# EAGLE design Roland (EAGLE 6.6.0)

## Sheet 1 of 2
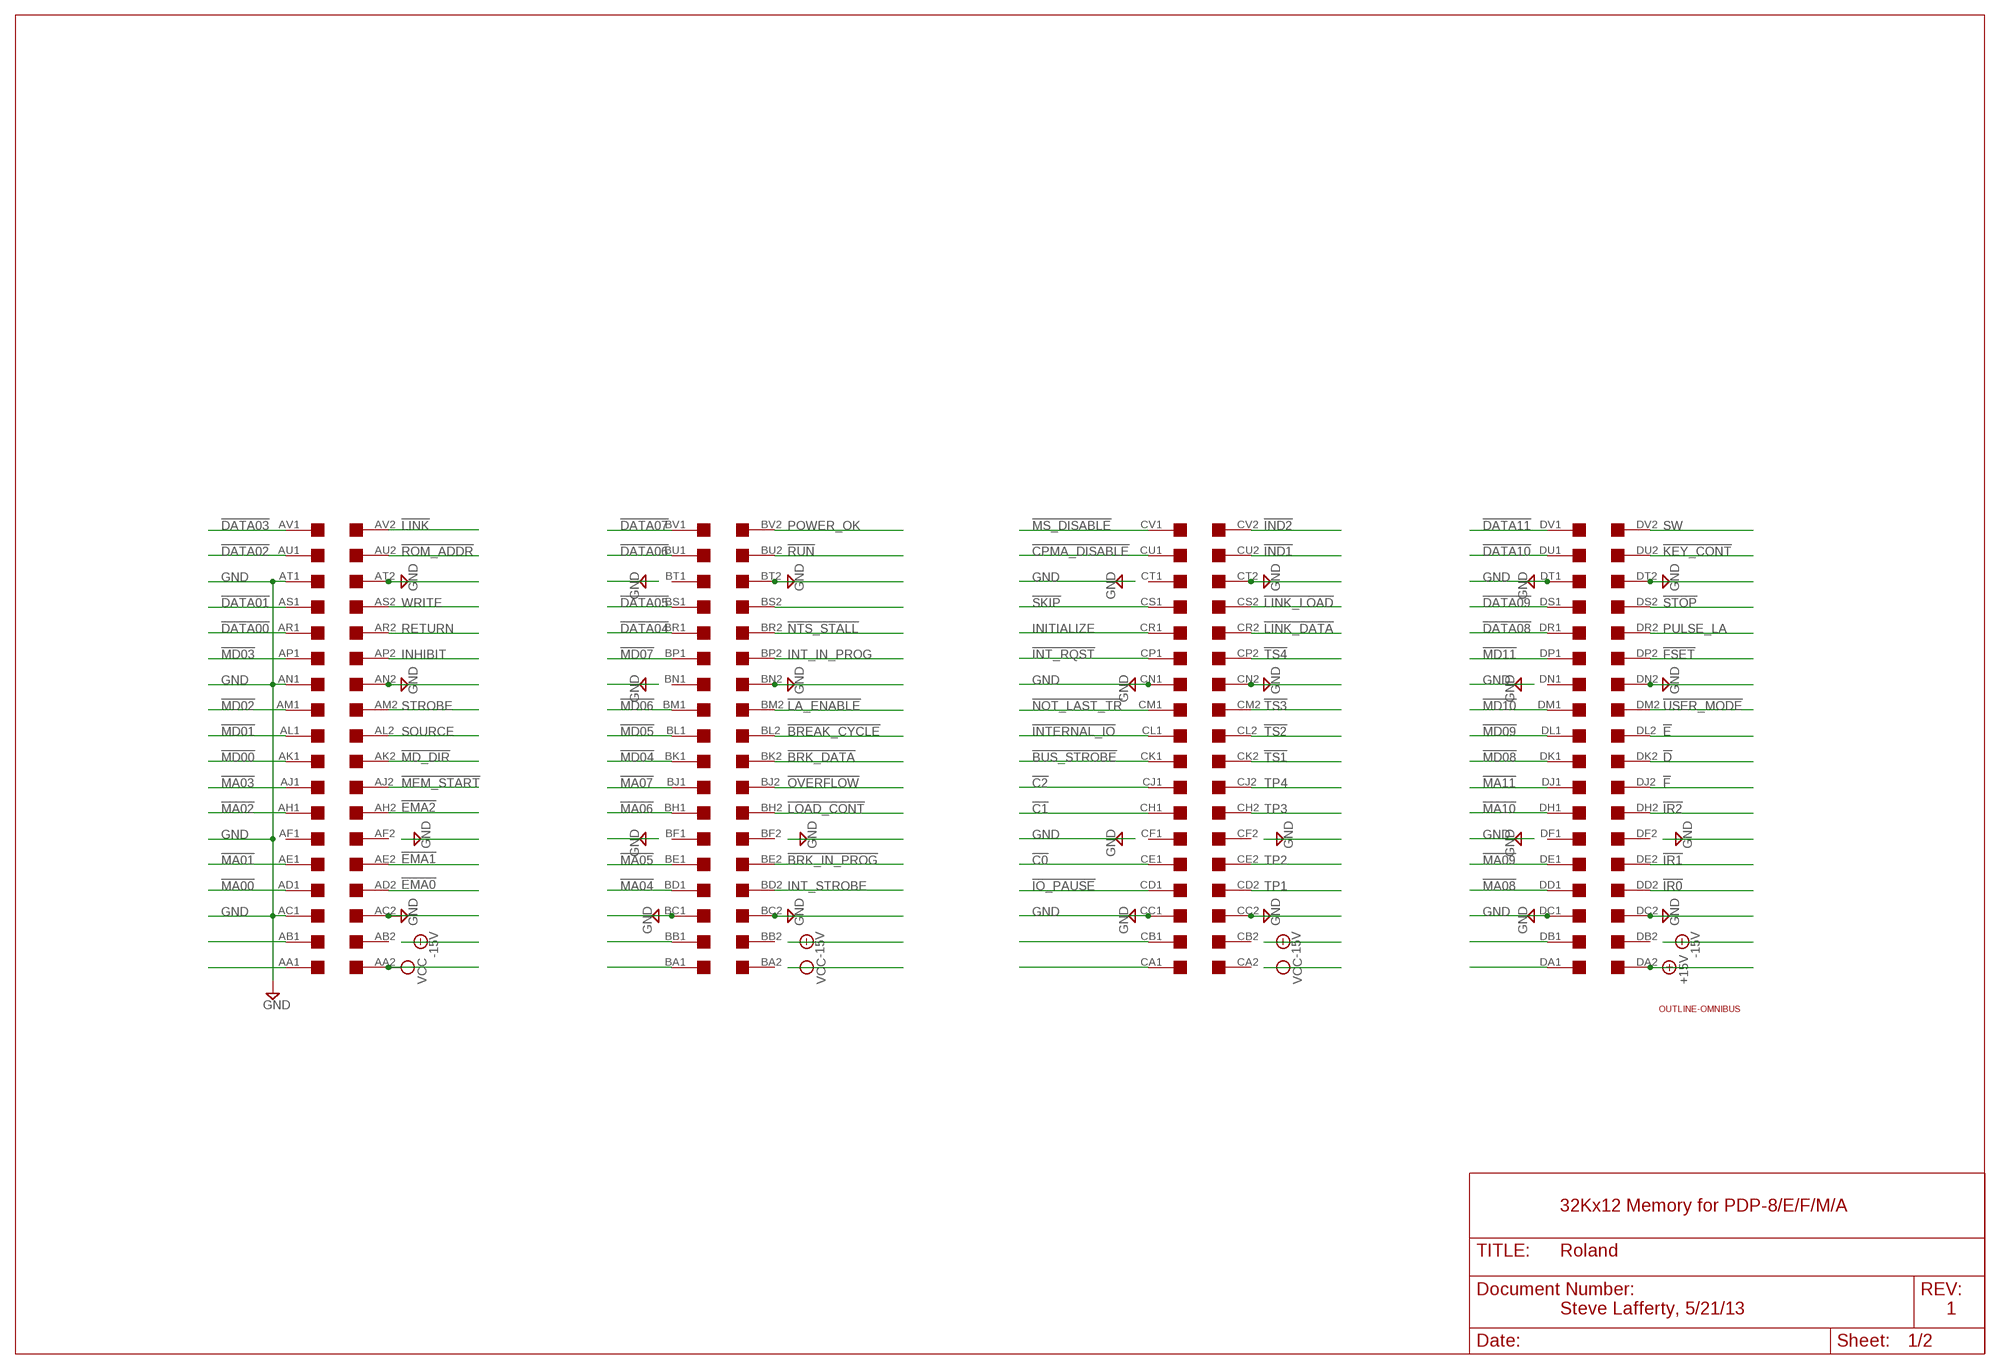
[diagram p0: schematic, sheet 1]

### Parts
J1  EDGE  QUAD  [EDGE-CON8]
U$1  OUTLINE-OMNIBUS  [OMNIBUS]

### Nets
!BREAK_CYCLE: J1.BL2
!BRK_DATA: J1.BK2 ; also sheet 2
!BRK_IN_PROG: J1.BE2
!BUS_STROBE: J1.CK1
!C0: J1.CE1
!C1: J1.CH1
!C2: J1.CJ1
!CPMA_DISABLE: J1.CU1
!D: J1.DK2
!DATA00: J1.AR1 ; also sheet 2
!DATA01: J1.AS1 ; also sheet 2
!DATA02: J1.AU1 ; also sheet 2
!DATA03: J1.AV1 ; also sheet 2
!DATA04: J1.BR1 ; also sheet 2
!DATA05: J1.BS1 ; also sheet 2
!DATA06: J1.BU1 ; also sheet 2
!DATA07: J1.BV1 ; also sheet 2
!DATA08: J1.DR1 ; also sheet 2
!DATA09: J1.DS1 ; also sheet 2
!DATA10: J1.DU1 ; also sheet 2
!DATA11: J1.DV1 ; also sheet 2
!E: J1.DL2
!EMA0: J1.AD2
!EMA1: J1.AE2
!EMA2: J1.AH2
!F: J1.DJ2
!FSET: J1.DP2
!IND1: J1.CU2
!IND2: J1.CV2
!INT_RQST: J1.CP1
!INTERNAL_IO: J1.CL1
!IO_PAUSE: J1.CD1
!IR0: J1.DD2
!IR1: J1.DE2
!IR2: J1.DH2
!KEY_CONT: J1.DU2 ; also sheet 2
!LA_ENABLE: J1.BM2 ; also sheet 2
!LINK: J1.AV2
!LINK_DATA: J1.CR2
!LINK_LOAD: J1.CS2
!LOAD_CONT: J1.BH2
!MA00: J1.AD1
!MA01: J1.AE1
!MA02: J1.AH1
!MA03: J1.AJ1
!MA04: J1.BD1
!MA05: J1.BE1
!MA06: J1.BH1
!MA07: J1.BJ1
!MA08: J1.DD1
!MA09: J1.DE1
!MA10: J1.DH1
!MA11: J1.DJ1
!MD00: J1.AK1
!MD01: J1.AL1
!MD02: J1.AM1
!MD03: J1.AP1
!MD04: J1.BK1
!MD05: J1.BL1
!MD06: J1.BM1
!MD07: J1.BP1
!MD08: J1.DK1
!MD09: J1.DL1
!MD10: J1.DM1
!MD11: J1.DP1
!MD_DIR: J1.AK2 ; also sheet 2
!MEM_START: J1.AJ2 ; also sheet 2
!MS_DISABLE: J1.CV1 ; also sheet 2
!NOT_LAST_TR: J1.CM1
!NTS_STALL: J1.BR2
!OVERFLOW: J1.BJ2
!ROM_ADDR: J1.AU2
!RUN: J1.BU2 ; also sheet 2
!SKIP: J1.CS1
!STOP: J1.DS2 ; also sheet 2
!TS1: J1.CK2
!TS2: J1.CL2
!TS3: J1.CM2
!TS4: J1.CP2 ; also sheet 2
!USER_MODE: J1.DM2
+15V: J1.DA2
GND [supply]: J1.AC1 J1.AC2 J1.AN1 J1.AN2 J1.AT1 J1.AT2 J1.BC1 J1.BC2 J1.BN2 J1.BT2 J1.CC1 J1.CC2 J1.CN1 J1.CN2 J1.CT2 J1.DC1 J1.DC2 J1.DN2 J1.DT1 J1.DT2 ; also sheet 2
INHIBIT: J1.AP2
INITIALIZE: J1.CR1 ; also sheet 2
INT_IN_PROG: J1.BP2
INT_STROBE: J1.BD2
N$46: J1.AB1
N$47: J1.AA1
N$48: J1.BB1
N$49: J1.BA1
N$50: J1.CA1
N$51: J1.BS2
N$52: J1.CB1
N$53: J1.DA1
N$54: J1.DB1
POWER_OK: J1.BV2
PULSE_LA: J1.DR2 ; also sheet 2
RETURN: J1.AR2
SOURCE: J1.AL2
STROBE: J1.AM2
SW: J1.DV2 ; also sheet 2
TP1: J1.CD2
TP2: J1.CE2
TP3: J1.CH2
TP4: J1.CJ2 ; also sheet 2
VCC [supply]: J1.AA2 ; also sheet 2
WRITE: J1.AS2
Unconnected: J1.AB2 J1.AF1 J1.AF2 J1.BA2 J1.BB2 J1.BF1 J1.BF2 J1.BN1 J1.BT1 J1.CA2 J1.CB2 J1.CF1 J1.CF2 J1.CT1 J1.DB2 J1.DF1 J1.DF2 J1.DN1

### Notes on the sheet
- 32Kx12 Memory for PDP-8/E/F/M/A
- Steve Lafferty, 5/21/13 | 1

## Sheet 2 of 2
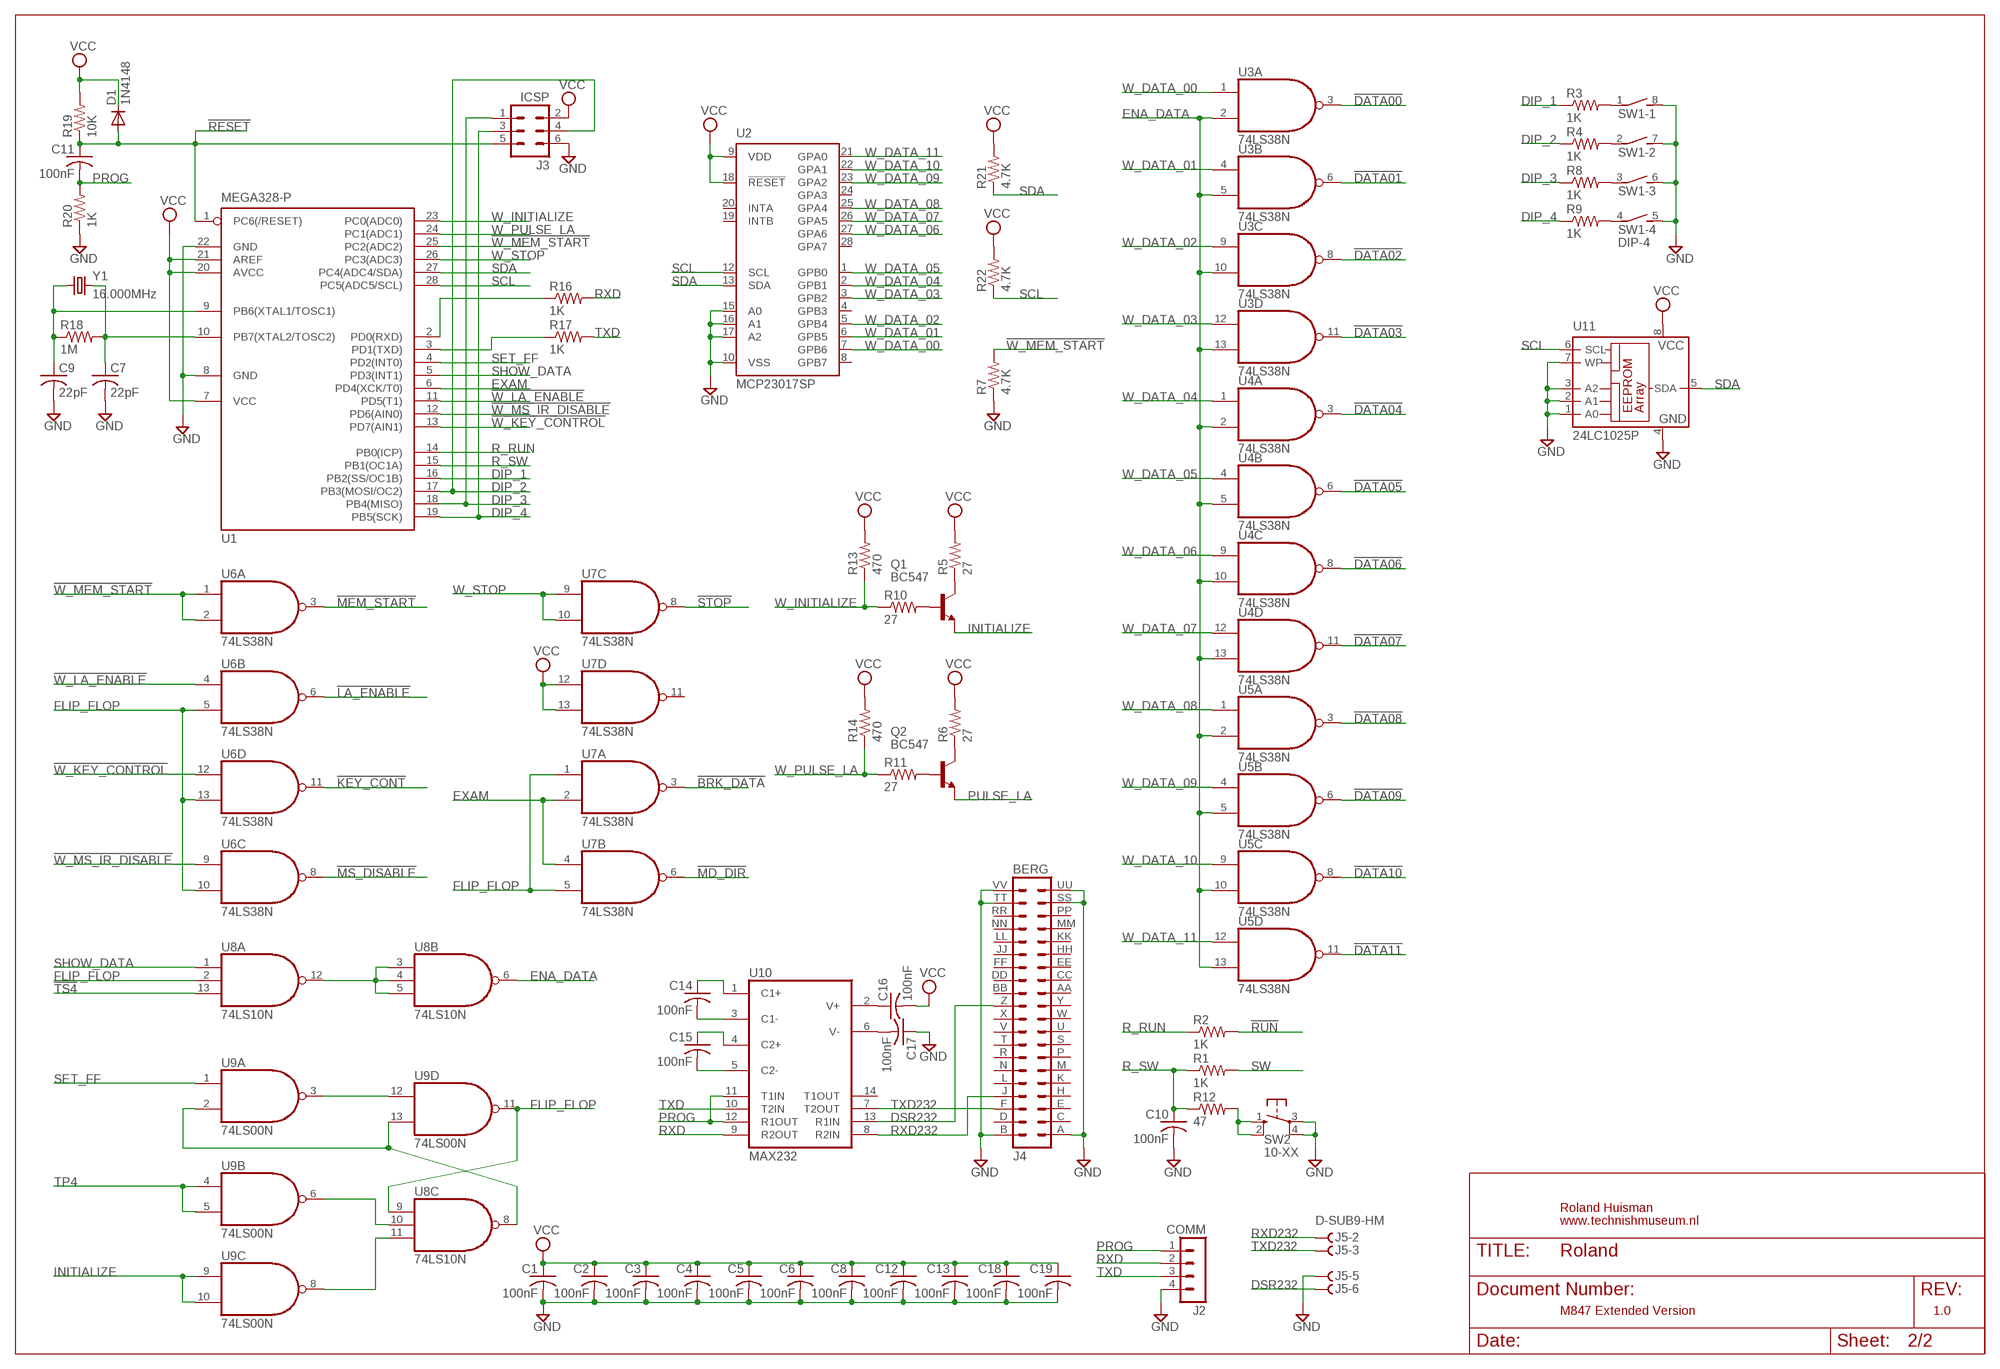
[diagram p1: schematic, sheet 2]

### Parts
C1  100nF  C-US050-025X075  [C050-025X075]
C2  100nF  C-US050-025X075  [C050-025X075]
C3  100nF  C-US050-025X075  [C050-025X075]
C4  100nF  C-US050-025X075  [C050-025X075]
C5  100nF  C-US050-025X075  [C050-025X075]
C6  100nF  C-US050-025X075  [C050-025X075]
C7  22pF  C-US050-025X075  [C050-025X075]
C8  100nF  C-US050-025X075  [C050-025X075]
C9  22pF  C-US050-025X075  [C050-025X075]
C10  100nF  C-US050-025X075  [C050-025X075]
C11  100nF  C-US050-025X075  [C050-025X075]
C12  100nF  C-US050-025X075  [C050-025X075]
C13  100nF  C-US050-025X075  [C050-025X075]
C14  100nF  C-US050-025X075  [C050-025X075]
C15  100nF  C-US050-025X075  [C050-025X075]
C16  100nF  C-US050-025X075  [C050-025X075]
C17  100nF  C-US050-025X075  [C050-025X075]
C18  100nF  C-US050-025X075  [C050-025X075]
C19  100nF  C-US050-025X075  [C050-025X075]
D1  1N4148  1N4148DO35-10  [DO35-10]
J2  COMM  MA04-1  [MA04-1]
J3  ICSP  MA03-2  [MA03-2]
J4  BERG  DEC40PINH  [DEC40PINH]
J5  D-SUB9-HM  D-SUB9-H5M09RA  [H5M09RA]
Q1  BC547  -NPN-TO5  [TO5]
Q2  BC547  -NPN-TO5  [TO5]
R1  1K  R-US_0207/15  [0207/15]
R2  1K  R-US_0207/15  [0207/15]
R3  1K  R-US_0207/15  [0207/15]
R4  1K  R-US_0207/15  [0207/15]
R5  27  R-US_0207/15  [0207/15]
R6  27  R-US_0207/15  [0207/15]
R7  4.7K  R-US_0207/15  [0207/15]
R8  1K  R-US_0207/15  [0207/15]
R9  1K  R-US_0207/15  [0207/15]
R10  27  R-US_0207/15  [0207/15]
R11  27  R-US_0207/15  [0207/15]
R12  47  R-US_0207/15  [0207/15]
R13  470  R-US_0207/15  [0207/15]
R14  470  R-US_0207/15  [0207/15]
R16  1K  R-US_0207/15  [0207/15]
R17  1K  R-US_0207/15  [0207/15]
R18  1M  R-US_0207/15  [0207/15]
R19  10K  R-US_0207/15  [0207/15]
R20  1K  R-US_0207/15  [0207/15]
R21  4.7K  R-US_0207/15  [0207/15]
R22  4.7K  R-US_0207/15  [0207/15]
SW1  DIP-4  DIP04S  [DIP04S]
SW2  10-XX  [B3F-10XX]
U1  MEGA328-P  MEGA8-P  [DIL28-3]
U2  MCP23017SP  [DIL28-3]
U3  74LS38N  [DIL14]
U4  74LS38N  [DIL14]
U5  74LS38N  [DIL14]
U6  74LS38N  [DIL14]
U7  74LS38N  [DIL14]
U8  74LS10N  [DIL14]
U9  74LS00N  [DIL14]
U10  MAX232  [DIL16]
U11  24LC1025P  24LC025P  [DIL8]
Y1  16.000MHz  CRYSTALHC49U-H  [HC49U-H]

### Nets
!BRK_DATA: U7.3(A:O) ; also sheet 1
!DATA00: U3.3(A:O) ; also sheet 1
!DATA01: U3.6(B:O) ; also sheet 1
!DATA02: U3.8(C:O) ; also sheet 1
!DATA03: U3.11(D:O) ; also sheet 1
!DATA04: U4.3(A:O) ; also sheet 1
!DATA05: U4.6(B:O) ; also sheet 1
!DATA06: U4.8(C:O) ; also sheet 1
!DATA07: U4.11(D:O) ; also sheet 1
!DATA08: U5.3(A:O) ; also sheet 1
!DATA09: U5.6(B:O) ; also sheet 1
!DATA10: U5.8(C:O) ; also sheet 1
!DATA11: U5.11(D:O) ; also sheet 1
!KEY_CONT: U6.11(D:O) ; also sheet 1
!LA_ENABLE: U6.6(B:O) ; also sheet 1
!MD_DIR: U7.6(B:O) ; also sheet 1
!MEM_START: U6.3(A:O) ; also sheet 1
!MS_DISABLE: U6.8(C:O) ; also sheet 1
!RESET: C11.1 D1.A J3.5 R19.1 U1.1(PC6(/RESET))
!RUN: R2.2 ; also sheet 1
!STOP: U7.8(C:O) ; also sheet 1
!TS4: U8.13(A:I2) ; also sheet 1
!W_KEY_CONTROL: U1.13(PD7(AIN1)) U6.12(D:I0)
!W_LA_ENABLE: U1.11(PD5(T1)) U6.4(B:I0)
!W_MEM_START: R7.2 U1.25(PC2(ADC2)) U6.1(A:I0) U6.2(A:I1)
!W_MS_IR_DISABLE: U1.12(PD6(AIN0)) U6.9(C:I0)
DIP_1: R3.1 U1.16(PB2(SS/OC1B))
DIP_2: J3.4 R4.1 U1.17(PB3(MOSI/OC2))
DIP_3: J3.1 R8.1 U1.18(PB4(MISO))
DIP_4: J3.3 R9.1 U1.19(PB5(SCK))
DSR232: J4.Z J5.6 U10.13(R1IN)
ENA_DATA: U3.2(A:I1) U3.5(B:I1) U3.10(C:I1) U3.13(D:I1) U4.2(A:I1) U4.5(B:I1) U4.10(C:I1) U4.13(D:I1) U5.2(A:I1) U5.5(B:I1) U5.10(C:I1) U5.13(D:I1) U8.6(B:O)
EXAM: U1.6(PD4(XCK/T0)) U7.2(A:I1) U7.4(B:I0)
FLIP_FLOP: U6.5(B:I1) U6.10(C:I1) U6.13(D:I1) U7.1(A:I0) U7.5(B:I1) U8.2(A:I1) U8.9(C:I0) U9.11(D:O)
GND [supply]: C1.2 C2.2 C3.2 C4.2 C5.2 C6.2 C7.2 C8.2 C9.2 C10.2 C12.2 C13.2 C17.1 C18.2 C19.2 J2.4 J3.6 J4.A J4.B J4.SS J4.TT J4.UU J4.VV J5.5 R7.1 R20.1 SW1.5 SW1.6 SW1.7 SW1.8 SW2.3(P) SW2.4(P1) U1.8(GND) U1.22(GND) U2.10(VSS) U2.15(A0) U2.16(A1) U2.17(A2) U11.1(A0) U11.2(A1) U11.3(A2) U11.4(GND) U11.7(WP) ; also sheet 1
INITIALIZE: Q1.1(E) U9.9(C:I0) U9.10(C:I1) ; also sheet 1
N$1: C7.1 R18.2 U1.10(PB7(XTAL2/TOSC2)) Y1.1
N$2: C9.1 R18.1 U1.9(PB6(XTAL1/TOSC1)) Y1.2
N$4: Q1.3(C) R5.1
N$5: Q1.2(B) R10.2
N$6: Q2.3(C) R6.1
N$7: Q2.2(B) R11.2
N$8: U9.3(A:O) U9.12(D:I0)
N$9: U8.3(B:I0) U8.4(B:I1) U8.5(B:I2) U8.12(A:O)
N$10: U8.8(C:O) U9.2(A:I1) U9.13(D:I1)
N$12: R17.1 U1.3(PD1(TXD))
N$13: R16.1 U1.2(PD0(RXD))
N$14: U8.10(C:I1) U9.6(B:O)
N$15: U8.11(C:I2) U9.8(C:O)
N$16: C17.2 U10.6(V-)
N$17: C14.1 U10.1(C1+)
N$827: C14.2 U10.3(C1-)
N$914: C15.2 U10.5(C2-)
N$915: C15.1 U10.4(C2+)
N$916: C16.1 U10.2(V+)
N$918: R12.2 SW2.1(S) SW2.2(S1)
N$919: R3.2 SW1.1
N$920: R4.2 SW1.2
N$921: R8.2 SW1.3
N$922: R9.2 SW1.4
PROG: C11.2 J2.1 R20.2 U10.11(T1IN) U10.12(R1OUT)
PULSE_LA: Q2.1(E) ; also sheet 1
R_RUN: R2.1 U1.14(PB0(ICP))
R_SW: C10.1 R1.1 R12.1 U1.15(PB1(OC1A))
RXD: J2.2 R16.2 U10.9(R2OUT)
RXD232: J4.J J5.2 U10.8(R2IN)
SCL: R22.1 U1.28(PC5(ADC5/SCL)) U2.12(SCL) U11.6(SCL)
SDA: R21.1 U1.27(PC4(ADC4/SDA)) U2.13(SDA) U11.5(SDA)
SET_FF: U1.4(PD2(INT0)) U9.1(A:I0)
SHOW_DATA: U1.5(PD3(INT1)) U8.1(A:I0)
SW: R1.2 ; also sheet 1
TP4: U9.4(B:I0) U9.5(B:I1) ; also sheet 1
TXD: J2.3 R17.2 U10.10(T2IN)
TXD232: J4.F J5.3 U10.7(T2OUT)
VCC [supply]: C1.1 C2.1 C3.1 C4.1 C5.1 C6.1 C8.1 C12.1 C13.1 C16.2 C18.1 C19.1 D1.C J3.2 R5.2 R6.2 R13.2 R14.2 R19.2 R21.2 R22.2 U1.7(VCC) U1.20(AVCC) U1.21(AREF) U2.9(VDD) U2.18(!RESET) U7.12(D:I0) U7.13(D:I1) U11.8(VCC) ; also sheet 1
W_DATA_00: U2.7(GPB6) U3.1(A:I0)
W_DATA_01: U2.6(GPB5) U3.4(B:I0)
W_DATA_02: U2.5(GPB4) U3.9(C:I0)
W_DATA_03: U2.3(GPB2) U3.12(D:I0)
W_DATA_04: U2.2(GPB1) U4.1(A:I0)
W_DATA_05: U2.1(GPB0) U4.4(B:I0)
W_DATA_06: U2.27(GPA6) U4.9(C:I0)
W_DATA_07: U2.26(GPA5) U4.12(D:I0)
W_DATA_08: U2.25(GPA4) U5.1(A:I0)
W_DATA_09: U2.23(GPA2) U5.4(B:I0)
W_DATA_10: U2.22(GPA1) U5.9(C:I0)
W_DATA_11: U2.21(GPA0) U5.12(D:I0)
W_INITIALIZE: R10.1 R13.1 U1.23(PC0(ADC0))
W_PULSE_LA: R11.1 R14.1 U1.24(PC1(ADC1))
W_STOP: U1.26(PC3(ADC3)) U7.9(C:I0) U7.10(C:I1)
Unconnected: J4.AA J4.BB J4.C J4.CC J4.D J4.DD J4.E J4.EE J4.FF J4.H J4.HH J4.JJ J4.K J4.KK J4.L J4.LL J4.M J4.MM J4.N J4.NN J4.P J4.PP J4.R J4.RR J4.S J4.T J4.U J4.V J4.W J4.X J4.Y J5.1 J5.4 J5.7 J5.8 J5.9 U2.4(GPB3) U2.8(GPB7) U2.19(INTB) U2.20(INTA) U2.24(GPA3) U2.28(GPA7) U7.11(D:O) U10.14(T1OUT)

### Notes on the sheet
- Roland Huisman
- D-SUB9-HM | www.technishmuseum.nl
- M847 Extended Version | 1.0

## Power pins joined to a net without a drawn wire
GND: U3.7(P:GND) U4.7(P:GND) U5.7(P:GND) U6.7(P:GND) U7.7(P:GND) U8.7(P:GND) U9.7(P:GND) U10.15(GND)
VCC: U3.14(P:VCC) U4.14(P:VCC) U5.14(P:VCC) U6.14(P:VCC) U7.14(P:VCC) U8.14(P:VCC) U9.14(P:VCC) U10.16(VCC)

## Library data of the parts
C1-C19 = rcl:C-US: CAPACITOR, American symbol
D1 = diode:1N4148: DIODE high speed (Philips)
J1 = dec-con:QUAD: Quad-Height DEC board
J2 = con-lstb:MA04-1: PIN HEADER; OC_FARNELL: unknown; OC_NEWARK: unknown
J3 = con-lstb:MA03-2: PIN HEADER; OC_FARNELL: unknown; OC_NEWARK: unknown
J4 = dec-con:DEC40PIN: PIN HEADER
J5 = con-thomas-betts:D-SUB9-: D-Subminiatur Connector Source: Electronioc Interconnects European Edition 1998; OC_FARNELL: unknown; OC_NEWARK: unknown
Q1 Q2 = transistor:*-NPN-: NPN Transistror BF959 corrected 2008.03.06
R1-R14 R16-R22 = rcl:R-US_: RESISTOR, American symbol
SW1 = switch-dil:DIP04S: DIL/CODE SWITCH; OC_FARNELL: unknown; OC_NEWARK: unknown
SW2 = switch-omron:10-XX: OMRON SWITCH; MPN: B3F-1000; OC_FARNELL: 176432; OC_NEWARK: 36M3542
U1 = atmel:MEGA8-P: MICROCONTROLLER 8 Kbytes FLASH, 1 kbytes SRAM, 512 bytes EEPROM, USART, 4-channel 10 bit ADC, 2-channel 8 bit ADC Pin compatible with Atmega48, ATMega88, ATMega168 Source: avr.lbr; OC_FARNELL: unknown; OC_NEWARK: unknown
U2 = microchip:MCP23017: http://ww1.microchip.com/downloads/en/DeviceDoc/21952a.pdf Source: http://ww1.microchip.com/downloads/en/DeviceDoc/21952a.pdf; MF: MICROCHIP; MPN: MCP23017-E/SP; OC_FARNELL: 1332088; OC_NEWARK: 31K2959
U3-U7 = dec-con:74*38: Quad 2-input NAND gate, open collector output
U8 = 74xx-us:74*10: Triple 3-input NAND gate
U9 = 74xx-us:74*00: Quad 2-input NAND gate
U10 = maxim:MAX232: RS232 TRANSCEIVER; MF: MAXIM; MPN: MAX232ACPE+; OC_FARNELL: 9723773; OC_NEWARK: 68K4544
U11 = microchip:24*: Serial EEPROM I2C; MF: MICROCHIP; MPN: 24LC025-I/P; OC_FARNELL: unknown; OC_NEWARK: 92C7098
U$1 = dec-con:OUTLINE-*: Board outlines for DEC boards.
Y1 = crystal:CRYSTAL: CRYSTAL; OC_FARNELL: 1666973; OC_NEWARK: unknown

## Net classes
0 default: width 0.508 mm
1 supply: width 0.813 mm

## Board
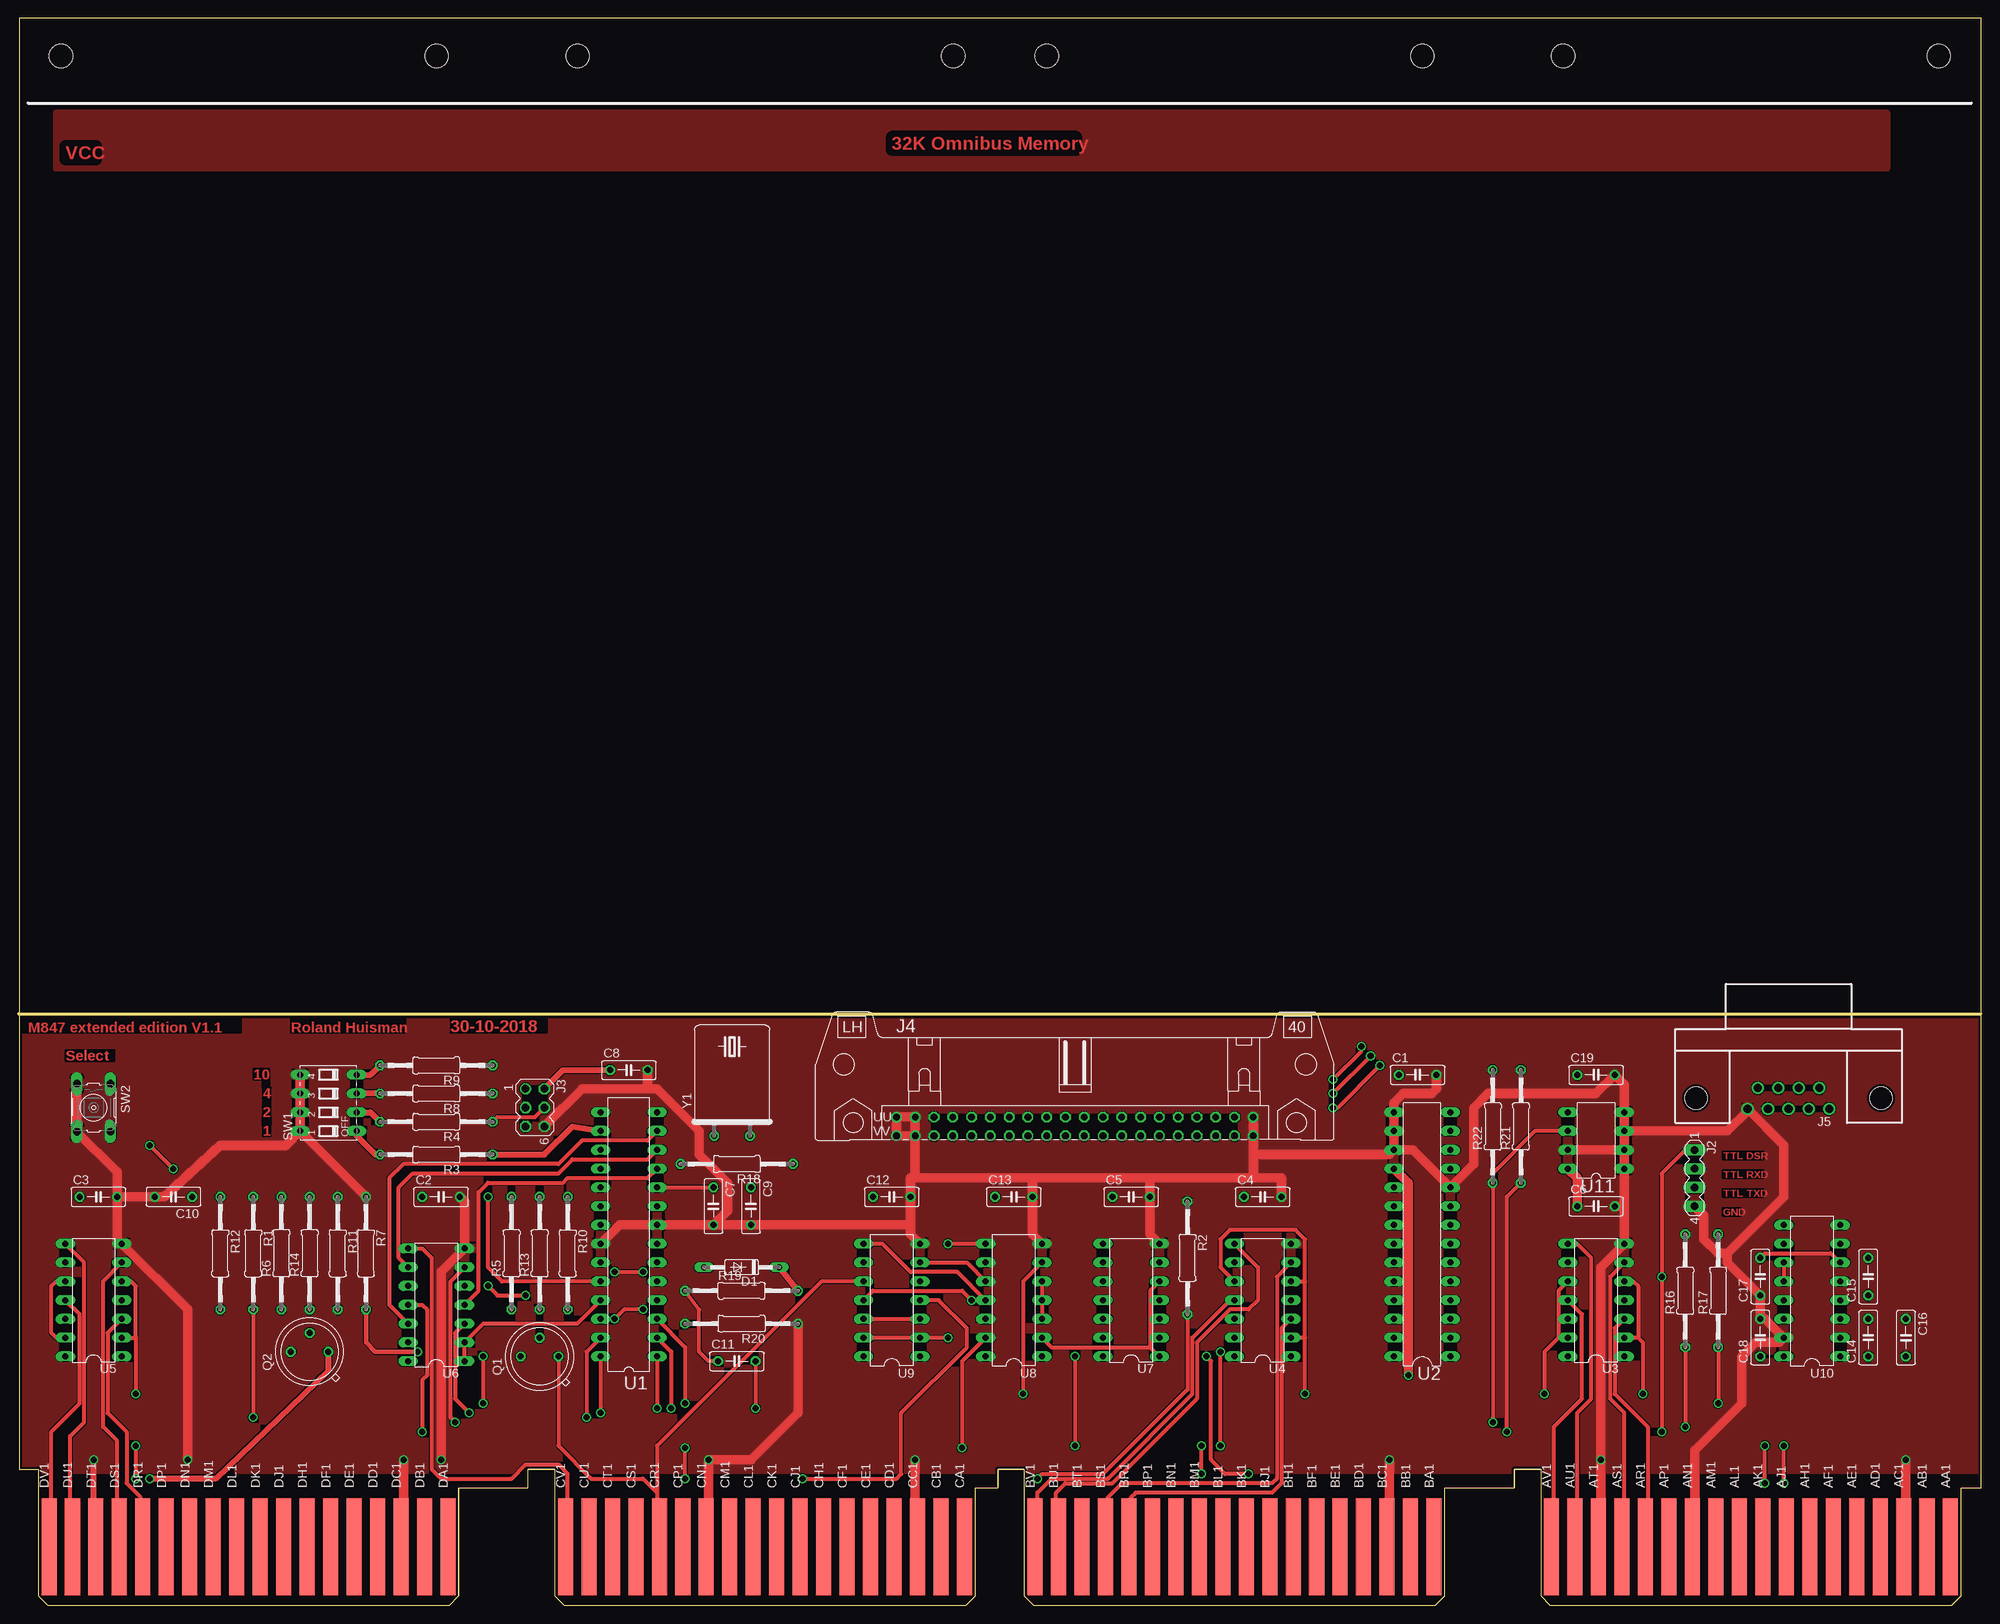
[diagram p2: board, top side]
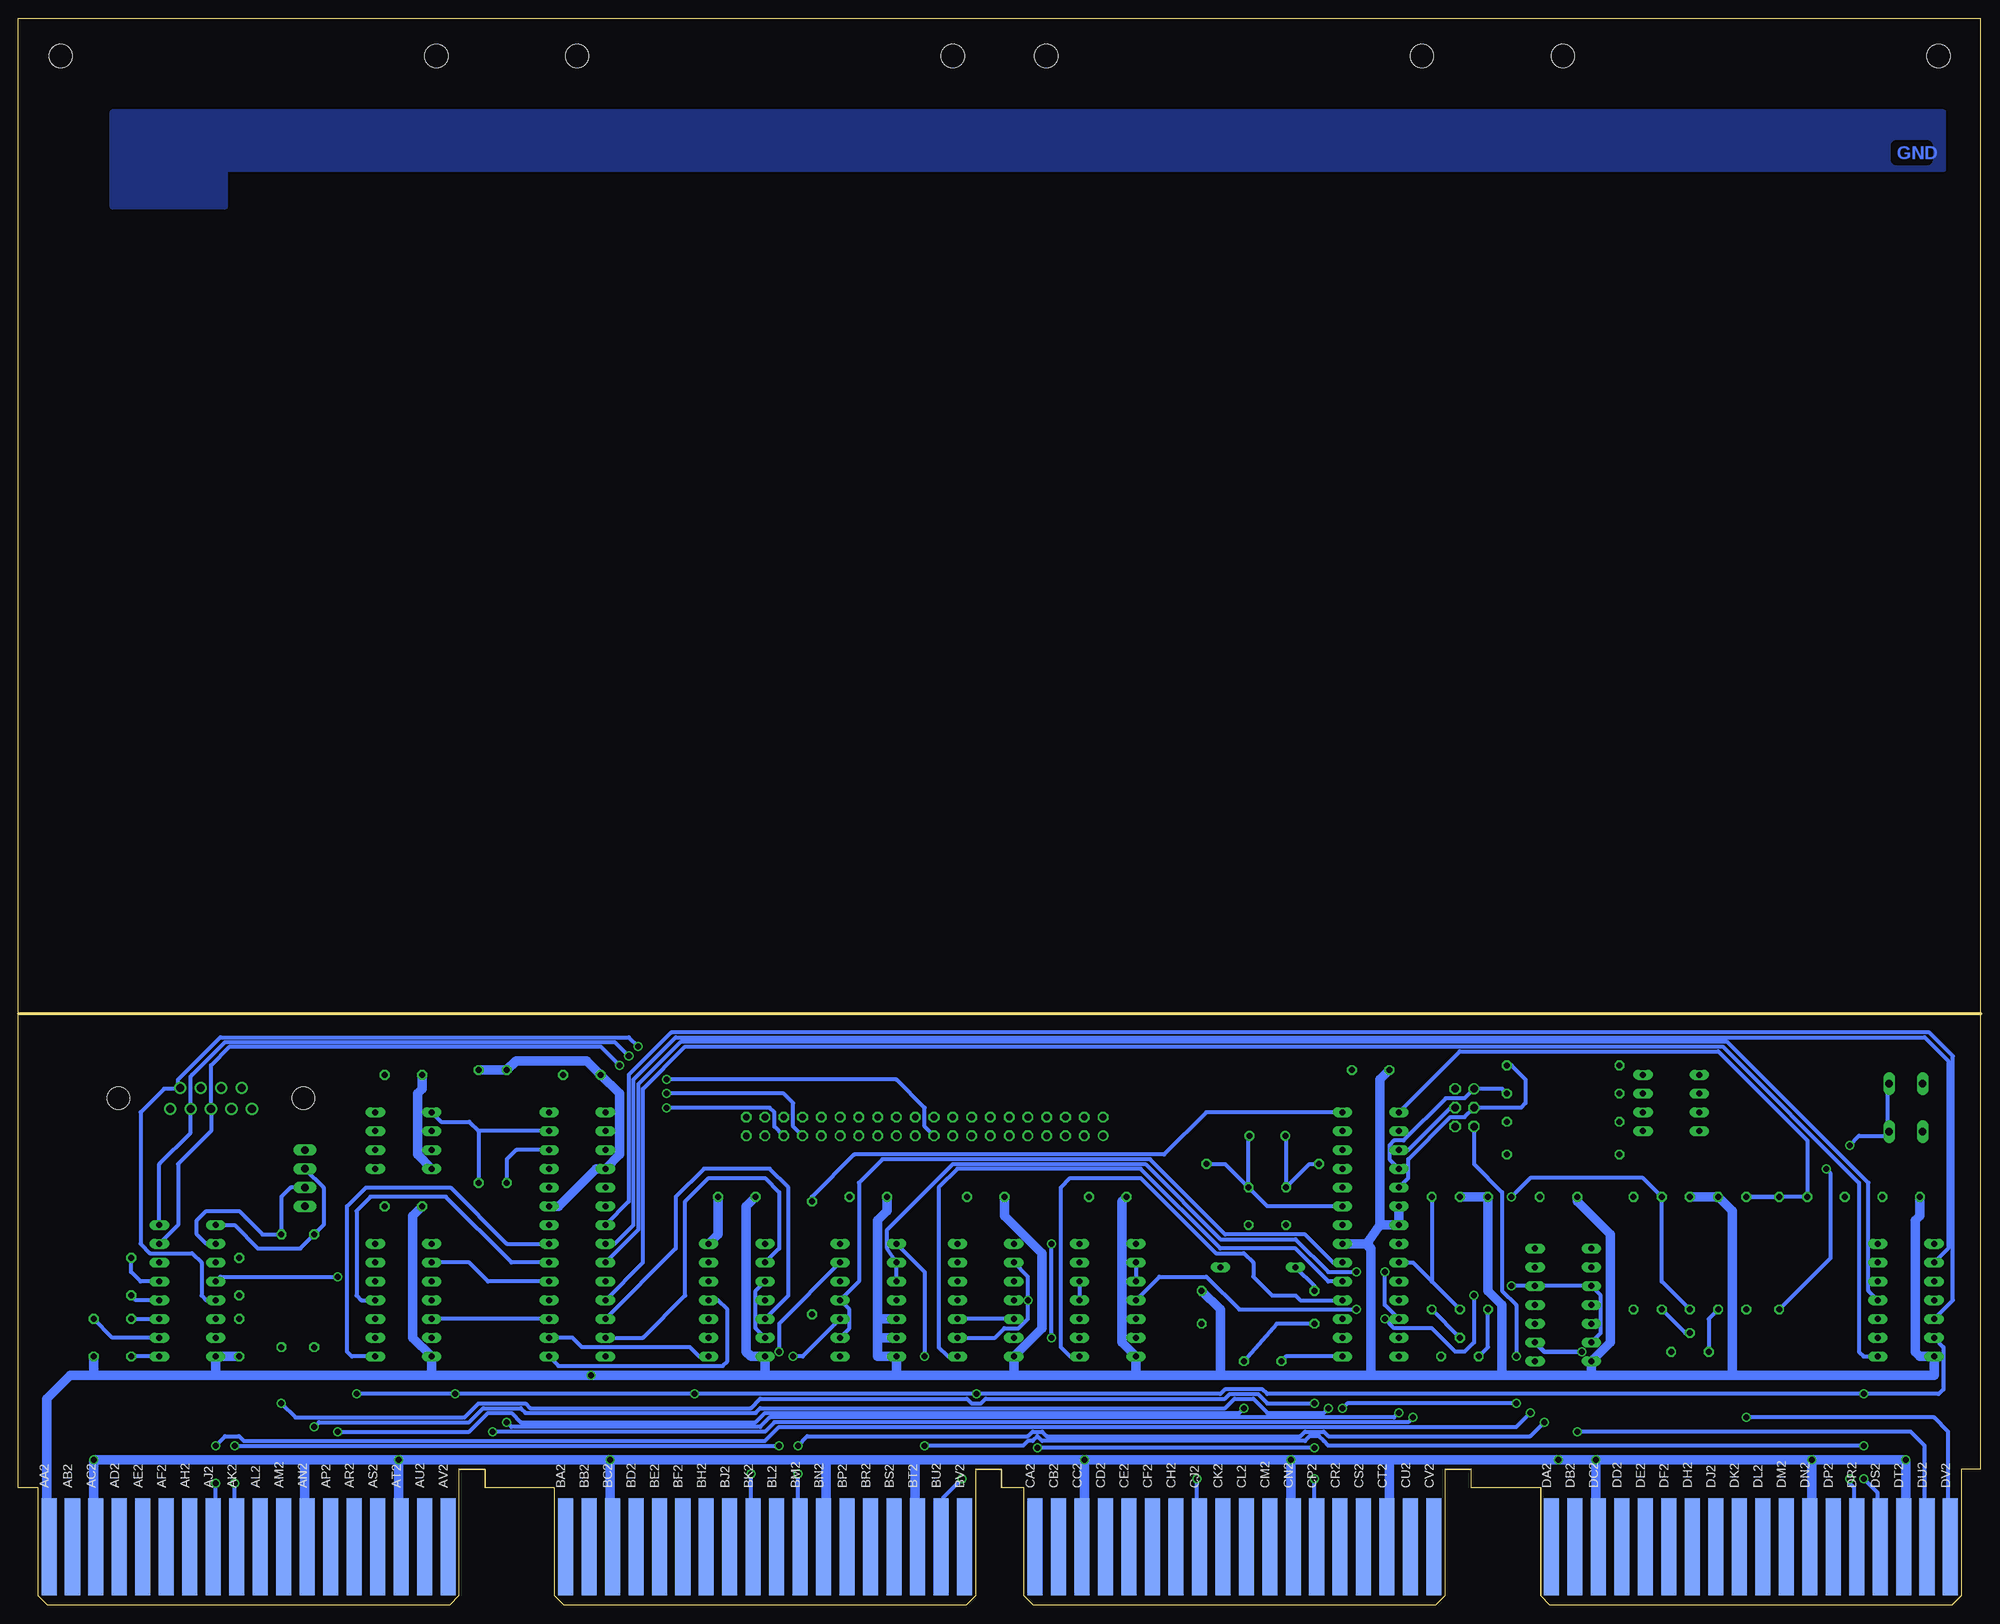
[diagram p3: board, bottom side, seen from below]

Size 265.43 x 214.63 mm. Coordinates in mm from the lower left corner, seen from the top.
Outline: 0,80.01 265.43,80.01
Copper layers (1+16): Top 0.035mm / dielectric 1.5mm / Bottom 0.035mm
Design rules "16mils *": minimum track width 16mil, minimum drill 32mil, track to track 5mil, track to pad 10mil, pad to pad 10mil, via to via 10mil, smd to smd 10mil, copper to edge 13mil, drill to drill 10mil, minimum pad ring 10mil, minimum via ring 8mil, stop-mask expansion 0mil, vias tented up to drill 0mil, thermal gap 10mil

### Footprints (pad centres in the part's own frame; a part is rotated, then mirrored left to right if it is on the bottom)
C050-025X075 = drill 0.813 octagon: 1 -2.54,0; 2 2.54,0
DO35-10 = drill 0.813 long: A 5.08,0; C -5.08,0
EDGE-CON8 = smd 2.032 x 13.106: AA1 261.303,7.938; AB1 258.127,7.938; AC1 254.952,7.938; AD1 251.778,7.938; AE1 248.602,7.938; AF1 245.428,7.938; AH1 242.252,7.938; AJ1 239.077,7.938; AK1 235.903,7.938; AL1 232.727,7.938; AM1 229.553,7.938; AN1 226.377,7.938; AP1 223.202,7.938; AR1 220.028,7.938; AS1 216.852,7.938; AT1 213.678,7.938; AU1 210.502,7.938; AV1 207.327,7.938; BA1 191.452,7.938; BB1 188.278,7.938; BC1 185.102,7.938; BD1 181.928,7.938; BE1 178.752,7.938; BF1 175.577,7.938; BH1 172.403,7.938; BJ1 169.227,7.938; BK1 166.053,7.938; BL1 162.877,7.938; BM1 159.702,7.938; BN1 156.528,7.938; BP1 153.352,7.938; BR1 150.178,7.938; BS1 147.002,7.938; BT1 143.827,7.938; BU1 140.653,7.938; BV1 137.477,7.938; CA1 127.953,7.938; CB1 124.778,7.938; CC1 121.603,7.938; CD1 118.427,7.938; CE1 115.252,7.938; CF1 112.078,7.938; CH1 108.903,7.938; CJ1 105.728,7.938; CK1 102.552,7.938; CL1 99.377,7.938; CM1 96.203,7.938; CN1 93.028,7.938; CP1 89.853,7.938; CR1 86.677,7.938; CS1 83.502,7.938; CT1 80.328,7.938; CU1 77.153,7.938; CV1 73.978,7.938; DA1 58.102,7.938; DB1 54.928,7.938; DC1 51.752,7.938; DD1 48.578,7.938; DE1 45.403,7.938; DF1 42.227,7.938; DH1 39.053,7.938; DJ1 35.877,7.938; DK1 32.703,7.938; DL1 29.527,7.938; DM1 26.352,7.938; DN1 23.177,7.938; DP1 20.003,7.938; DR1 16.828,7.938; DS1 13.652,7.938; DT1 10.477,7.938; DU1 7.303,7.938; DV1 4.128,7.938 | smd 2.032 x 13.106 bottom: AA2 261.303,7.938; AB2 258.127,7.938; AC2 254.952,7.938; AD2 251.778,7.938; AE2 248.602,7.938; AF2 245.428,7.938; AH2 242.252,7.938; AJ2 239.077,7.938; AK2 235.903,7.938; AL2 232.727,7.938; AM2 229.553,7.938; AN2 226.377,7.938; AP2 223.202,7.938; AR2 220.028,7.938; AS2 216.852,7.938; AT2 213.678,7.938; AU2 210.502,7.938; AV2 207.327,7.938; BA2 191.452,7.938; BB2 188.278,7.938; BC2 185.102,7.938; BD2 181.928,7.938; BE2 178.752,7.938; BF2 175.577,7.938; BH2 172.403,7.938; BJ2 169.227,7.938; BK2 166.053,7.938; BL2 162.877,7.938; BM2 159.702,7.938; BN2 156.528,7.938; BP2 153.352,7.938; BR2 150.178,7.938; BS2 147.002,7.938; BT2 143.827,7.938; BU2 140.653,7.938; BV2 137.477,7.938; CA2 127.953,7.938; CB2 124.778,7.938; CC2 121.603,7.938; CD2 118.427,7.938; CE2 115.252,7.938; CF2 112.078,7.938; CH2 108.903,7.938; CJ2 105.728,7.938; CK2 102.552,7.938; CL2 99.377,7.938; CM2 96.203,7.938; CN2 93.028,7.938; CP2 89.853,7.938; CR2 86.677,7.938; CS2 83.502,7.938; CT2 80.328,7.938; CU2 77.153,7.938; CV2 73.978,7.938; DA2 58.102,7.938; DB2 54.928,7.938; DC2 51.752,7.938; DD2 48.578,7.938; DE2 45.403,7.938; DF2 42.227,7.938; DH2 39.053,7.938; DJ2 35.877,7.938; DK2 32.703,7.938; DL2 29.527,7.938; DM2 26.352,7.938; DN2 23.177,7.938; DP2 20.003,7.938; DR2 16.828,7.938; DS2 13.652,7.938; DT2 10.477,7.938; DU2 7.303,7.938; DV2 4.128,7.938
MA04-1 = drill 1.016 long: 1 -3.81,0; 2 -1.27,0; 3 1.27,0; 4 3.81,0
MA03-2 = drill 1.016: 1 -2.54,-1.27 | drill 1.016 octagon: 2 -2.54,1.27; 3 0,-1.27; 4 0,1.27; 5 2.54,-1.27; 6 2.54,1.27
DEC40PINH = drill 0.914 octagon: A 24.13,1.27; AA -3.81,1.27; B 24.13,-1.27; BB -3.81,-1.27; C 21.59,1.27; CC -6.35,1.27; D 21.59,-1.27; DD -6.35,-1.27; E 19.05,1.27; EE -8.89,1.27; F 19.05,-1.27; FF -8.89,-1.27; H 16.51,1.27; HH -11.43,1.27; J 16.51,-1.27; JJ -11.43,-1.27; K 13.97,1.27; KK -13.97,1.27; L 13.97,-1.27; LL -13.97,-1.27; M 11.43,1.27; MM -16.51,1.27; N 11.43,-1.27; NN -16.51,-1.27; P 8.89,1.27; PP -19.05,1.27; R 8.89,-1.27; RR -19.05,-1.27; S 6.35,1.27; SS -21.59,1.27; T 6.35,-1.27; TT -21.59,-1.27; U 3.81,1.27; UU -24.13,1.27; V 3.81,-1.27; W 1.27,1.27; X 1.27,-1.27; Y -1.27,1.27; Z -1.27,-1.27 | drill 0.914: VV -24.13,-1.27
H5M09RA = drill 1.092: 1 -5.537,1.422; 2 -2.769,1.422; 3 0,1.422; 4 2.769,1.422; 5 5.537,1.422; 6 -4.153,-1.422; 7 -1.384,-1.422; 8 1.384,-1.422; 9 4.153,-1.422 | hole 3.048: -12.497,0; 12.497,0
TO5 = drill 0.813 octagon: 1 0,-2.54; 2 2.54,0; 3 0,2.54
0207/15 = drill 0.813 octagon: 1 -7.62,0; 2 7.62,0
DIP04S = drill 0.813 long: 1 -3.81,-3.81; 2 -1.27,-3.81; 3 1.27,-3.81; 4 3.81,-3.81; 5 3.81,3.81; 6 1.27,3.81; 7 -1.27,3.81; 8 -3.81,3.81
B3F-10XX = drill 1.016 long: 1 -3.251,2.261; 2 3.251,2.261; 3 -3.251,-2.261; 4 3.251,-2.261
DIL28-3 = drill 0.813 long: 1 -16.51,-3.81; 2 -13.97,-3.81; 3 -11.43,-3.81; 4 -8.89,-3.81; 5 -6.35,-3.81; 6 -3.81,-3.81; 7 -1.27,-3.81; 8 1.27,-3.81; 9 3.81,-3.81; 10 6.35,-3.81; 11 8.89,-3.81; 12 11.43,-3.81; 13 13.97,-3.81; 14 16.51,-3.81; 15 16.51,3.81; 16 13.97,3.81; 17 11.43,3.81; 18 8.89,3.81; 19 6.35,3.81; 20 3.81,3.81; 21 1.27,3.81; 22 -1.27,3.81; 23 -3.81,3.81; 24 -6.35,3.81; 25 -8.89,3.81; 26 -11.43,3.81; 27 -13.97,3.81; 28 -16.51,3.81
DIL14 = drill 0.813 long: 1 -7.62,-3.81; 2 -5.08,-3.81; 3 -2.54,-3.81; 4 0,-3.81; 5 2.54,-3.81; 6 5.08,-3.81; 7 7.62,-3.81; 8 7.62,3.81; 9 5.08,3.81; 10 2.54,3.81; 11 0,3.81; 12 -2.54,3.81; 13 -5.08,3.81; 14 -7.62,3.81
DIL16 = drill 0.813 long: 1 -8.89,-3.81; 2 -6.35,-3.81; 3 -3.81,-3.81; 4 -1.27,-3.81; 5 1.27,-3.81; 6 3.81,-3.81; 7 6.35,-3.81; 8 8.89,-3.81; 9 8.89,3.81; 10 6.35,3.81; 11 3.81,3.81; 12 1.27,3.81; 13 -1.27,3.81; 14 -3.81,3.81; 15 -6.35,3.81; 16 -8.89,3.81
DIL8 = drill 0.813 long: 1 -3.81,-3.81; 2 -1.27,-3.81; 3 1.27,-3.81; 4 3.81,-3.81; 5 3.81,3.81; 6 1.27,3.81; 7 -1.27,3.81; 8 -3.81,3.81
OMNIBUS = hole 3.175: 208.915,209.55; 259.715,209.55; 189.865,209.55; 139.065,209.55; 75.616,209.55; 126.416,209.55; 56.566,209.55; 5.766,209.55
HC49U-H = drill 0.813: 1 -2.413,-5.08; 2 2.413,-5.08

### Placement (x,y rotation side)
C1  189.23,71.75 0 top
C2  57.15,55.24 0 top
C3  10.79,55.24 0 top
C4  168.28,55.24 0 top
C5  150.5,55.24 0 top
C6  213.36,53.98 0 top
C7  93.98,53.98 270 top
C8  82.55,72.39 0 top
C9  99.06,53.98 270 top
C10  20.95,55.24 180 top
C11  97.16,33.02 0 top
C12  118.11,55.24 0 top
C13  134.62,55.24 0 top
C14  250.19,36.2 90 top
C15  250.19,44.45 90 top
C16  255.27,36.2 270 top
C17  235.59,44.45 90 top
C18  235.59,36.2 90 top
C19  213.36,71.75 0 top
D1  97.79,45.72 180 top
J1  0,0 0 top
J2  226.69,57.78 270 top
J3  69.85,67.31 270 top
J4  142.88,64.77 0 top
J5  239.4,68.58 180 top
Q1  70.48,33.66 90 top
Q2  39.37,34.29 90 top
R1  31.75,47.62 270 top
R2  158.12,46.99 270 top
R3  56.52,60.96 180 top
R4  56.52,65.41 180 top
R5  66.67,47.62 90 top
R6  35.56,47.62 90 top
R7  46.99,47.62 270 top
R8  56.52,69.22 180 top
R9  56.52,73.03 180 top
R10  74.3,47.62 270 top
R11  43.18,47.62 270 top
R12  27.3,47.62 270 top
R13  70.48,47.62 90 top
R14  39.37,47.62 90 top
R16  225.43,42.55 90 top
R17  229.87,42.55 90 top
R18  97.16,59.69 180 top
R19  97.79,42.55 0 top
R20  97.79,38.1 180 top
R21  203.2,64.77 90 top
R22  199.39,64.77 90 top
SW1  41.91,67.94 90 top
SW2  10.16,67.31 270 top
U1  82.55,50.16 90 top
U2  189.87,50.16 90 top
U3  213.36,41.27 90 top
U4  168.28,41.27 90 top
U5  10.16,41.27 90 top
U6  56.52,40.64 90 top
U7  150.5,41.27 90 top
U8  134.62,41.27 90 top
U9  118.11,41.27 90 top
U10  242.57,42.55 90 top
U11  213.36,62.87 90 top
U$1  0,0 0 top
Y1  96.52,68.58 0 top

### Tracks (layer width: path | path; a pad name or v marks a point on that pad's centre or on a via)
!BRK_DATA  (via drill 0.81)
  Top 0.508: v166.37,17.78 163.19,17.78 161.29,19.68 161.29,33.02 v160.66,33.66
  Bottom 0.508: J1.BK2 166.37,8.26 v166.37,17.78 | U7.3 159.38,33.66 v160.66,33.66
!DATA00
  Top 0.508: U3.3 215.9,37.47 215.9,28.57 220.34,24.13 220.34,8.26 J1.AR1
!DATA01
  Top 0.508: J1.AS1 217.17,8.26 217.17,26.04 215.26,27.94 215.26,44.45 U3.6
!DATA02
  Top 0.508: J1.AU1 210.82,8.26 210.82,26.04 212.72,27.94 212.72,46.99 210.82,48.9 U3.8
!DATA03
  Top 0.508: J1.AV1 207.65,8.26 207.65,24.13 211.46,27.94 211.46,39.37 U3.11
!DATA04
  Top 0.508: U4.3 170.81,37.47 170.81,16.51 169.54,15.24 151.13,15.24 150.5,14.61 150.5,8.26 J1.BR1
!DATA05
  Top 0.508: U4.6 170.18,44.45 170.18,17.14 169.54,16.51 149.22,16.51 147.32,14.61 147.32,8.26 J1.BS1
!DATA06
  Top 0.508: J1.BU1 140.34,8.26 140.34,15.24 141.6,16.51 147.96,16.51 159.38,27.94 159.38,35.56 163.83,40.01 166.37,40.01 167.64,41.27 167.64,45.72 U4.8
!DATA07
  Top 0.508: J1.BV1 137.79,8.26 137.79,15.24 139.7,17.14 147.32,17.14 158.75,28.57 158.75,36.2 163.83,41.27 U4.11
!DATA08
  Top 0.508: U5.3 12.06,36.83 12.06,26.04 14.61,23.5 14.61,16.51 16.51,14.61 16.51,8.26 J1.DR1
!DATA09
  Top 0.508: J1.DS1 13.34,8.26 13.34,22.23 11.43,24.13 11.43,43.81 U5.6
!DATA10
  Top 0.508: J1.DU1 6.99,8.26 6.99,22.86 8.89,24.77 8.89,46.35 U5.8
!DATA11
  Top 0.508: J1.DV1 4.45,8.26 4.45,23.5 8.26,27.3 8.26,39.37 U5.11
!KEY_CONT  (via drill 0.81)
  Top 0.508: U6.11 54.61,40.64 55.24,40.01 55.24,31.11 54.61,30.48 v54.61,23.5
  Bottom 0.508: J1.DU2 7.62,8.26 7.62,21.59 9.53,23.5 v54.61,23.5
!LA_ENABLE  (via drill 0.81)
  Top 0.508: v160.02,17.78 v160.02,21.59 | v59.05,24.77 58.42,25.4 58.42,43.81 U6.6
  Bottom 0.508: J1.BM2 160.02,8.26 v160.02,17.78 | v160.02,21.59 158.75,22.86 128.91,22.86 128.27,23.5 127,23.5 126.36,22.86 92.08,22.86 91.44,23.5 88.9,23.5 88.27,22.86 60.96,22.86 v59.05,24.77
!MD_DIR  (via drill 0.81)
  Top 0.508: v236.22,16.51 v236.22,21.59 | v162.56,21.59 v162.56,34.29
  Bottom 0.508: J1.AK2 236.22,8.26 v236.22,16.51 | U7.6 162.56,38.1 v162.56,34.29 | v236.22,21.59 v162.56,21.59
!MEM_START  (via drill 0.81)
  Top 0.508: v238.76,16.51 v238.76,21.59 | U6.3 59.05,36.83 59.05,27.94 v60.96,26.04
  Bottom 0.508: J1.AJ2 238.76,8.26 v238.76,16.51 | v238.76,21.59 237.49,22.86 235.59,22.86 234.95,22.23 164.47,22.23 162.56,24.13 62.87,24.13 v60.96,26.04
!MS_DISABLE
  Top 0.508: U6.8 54.61,48.26 55.88,46.99 55.88,18.41 57.15,17.14 66.67,17.14 68.58,19.05 73.03,19.05 74.3,17.78 74.3,8.26 J1.CV1
!RESET  (via drill 0.81)
  Top 0.508: C11.1 93.34,33.02 92.08,34.29 92.08,40.01 R19.1 | v62.87,33.66 v62.87,27.3 | U1.1 v86.36,26.67
  Bottom 0.508: J3.5 68.58,59.69 64.77,55.88 64.77,42.55 62.87,40.64 v62.87,33.66 | D1.A 90.17,43.18 R19.1 | v62.87,27.3 85.72,27.3 v86.36,26.67 | U1.1 93.98,33.66 C11.1
!RUN  (via drill 0.81)
  Top 0.508: v137.79,17.14 138.43,17.78 146.69,17.78 158.12,29.21 R2.2
  Bottom 0.508: J1.BU2 140.34,8.26 140.34,14.61 v137.79,17.14
!STOP  (via drill 0.81)
  Top 0.508: v15.88,21.59 v15.88,17.14 | v142.88,33.66 v142.88,21.59
  Bottom 0.508: J1.DS2 13.97,8.26 13.97,15.24 v15.88,17.14 | v15.88,21.59 88.27,21.59 88.9,22.23 89.53,22.86 90.81,22.86 91.44,22.23 127,22.23 127.64,22.86 128.27,22.23 128.91,22.23 129.54,21.59 v142.88,21.59 | U7.8 142.88,45.09 v142.88,33.66
!TS4  (via drill 0.81)
  Top 0.508: v90.17,17.14 v90.17,21.27 | U8.13 127.64,33.02 v127.64,21.27
  Bottom 0.508: J1.CP2 90.17,8.26 v90.17,17.14 | v90.17,21.27 v127.64,21.27
!W_KEY_CONTROL
  Top 0.508: U1.13 85.09,62.87 76.2,62.87 73.03,59.69 52.07,59.69 50.16,57.78 50.16,40.64 U6.12
!W_LA_ENABLE
  Top 0.508: U6.4 62.23,42.55 62.23,55.88 63.5,57.15 73.66,57.15 74.3,57.78 85.09,57.78 U1.11
!W_MEM_START  (via drill 0.81)
  Top 0.508: U6.1 U6.2 62.87,38.1 75.56,38.1 U1.25
  Top 0.61: R7.2 46.99,35.56 48.26,34.29 v53.98,34.29
  Bottom 0.61: U6.2 59.05,34.29 v53.98,34.29
!W_MS_IR_DISABLE
  Top 0.508: U6.9 51.44,46.99 51.44,56.52 53.34,58.42 73.03,58.42 74.93,60.33 85.09,60.33 U1.12
DIP_1
  Top 0.813: R3.1 71.12,60.96 74.93,64.77 U1.16
DIP_2
  Top 0.508: R4.1 64.77,66.04 69.85,66.04 J3.4
  Bottom 0.508: J3.4 71.75,67.31 77.47,61.59 U1.17
DIP_3
  Bottom 0.508: R8.1 64.77,69.85 J3.1 69.85,68.58 72.39,68.58 78.11,62.87 79.38,62.87 80.01,62.23 80.01,60.33 U1.18
DIP_4
  Bottom 0.508: U1.19 77.47,57.78 77.47,60.33 71.75,66.04 69.85,66.04 J3.3 62.23,67.31 61.59,67.94 61.59,71.12 63.5,73.03 R9.1
DSR232  (via drill 0.81)
  Top 0.508: v177.8,71.12 181.61,74.93 v181.61,75.56
  Bottom 0.508: J4.Z 142.88,64.77 142.88,67.31 146.69,71.12 v177.8,71.12 | v181.61,75.56 182.88,76.83 238.12,76.83 243.84,71.12 243.84,70.29 J5.6 243.7,69.85 245.75,69.85 248.92,66.67 248.92,48.9 247.65,47.62 241.94,47.62 240.66,46.35 240.66,41.91 240.03,41.27 U10.13
ENA_DATA  (via drill 0.81)
  Top 0.508: v173.99,28.57 173.99,36.2 | 173.99,36.2 U4.2 | v219.71,28.57 219.71,35.56 219.07,36.2 | U8.6 135.89,43.81 v135.89,28.57 | U3.10 208.28,42.55 208.28,36.2 | 208.28,36.2 U3.13 | 208.28,36.2 206.38,34.29 v206.38,28.57 | U4.5 173.99,43.81 | 173.99,43.81 173.99,49.53 172.72,50.8 163.83,50.8 162.56,49.53 162.56,45.72 U4.10 | 173.99,36.2 173.99,43.81 | U5.13 5.08,36.2 4.45,36.83 4.45,43.18 5.08,43.81 U5.10 | U5.2 15.88,36.2 | 15.88,36.2 15.88,43.18 15.24,43.81 U5.5 | 15.88,36.2 v15.88,28.57 | U3.5 218.44,43.81 219.07,43.18 219.07,36.2 | 219.07,36.2 U3.2
  Bottom 0.508: U5.13 5.08,34.92 5.08,29.21 5.71,28.57 v15.88,28.57 96.52,28.57 97.16,29.21 102.23,29.21 102.87,28.57 v135.89,28.57 v173.99,28.57 v206.38,28.57 v219.71,28.57 | U4.13 165.74,37.47 165.74,42.55 U4.10
EXAM
  Bottom 0.508: U1.6 87.63,46.35 91.44,50.16 102.23,50.16 112.39,60.33 148.59,60.33 151.76,57.15 151.76,43.81 U7.4 153.03,40.01 153.03,37.47 U7.2
FLIP_FLOP  (via drill 0.81)
  Top 0.508: U9.11 115.57,42.55 127.64,42.55 v128.91,41.27 | U8.2 139.7,34.92 153.03,34.92 | 153.03,34.92 U7.1 | U7.5 153.03,42.55 153.03,34.92 | v63.5,43.18 64.77,41.91 v68.58,41.91 | v84.45,40.01 81.92,40.01 v80.64,38.73
  Bottom 0.508: U6.13 51.44,36.83 51.44,41.91 U6.10 U6.5 v63.5,43.18 | U9.11 111.12,44.45 104.78,44.45 100.33,40.01 v84.45,40.01 | U8.2 133.35,36.2 132.08,37.47 130.18,37.47 128.91,38.73 v128.91,41.27 128.91,44.45 U8.9 | v68.58,41.91 68.58,35.56 69.85,34.29 71.12,34.29 74.3,37.47 79.38,37.47 v80.64,38.73
GND  (via drill 0.81)
  Top 0.813: J1.DT2 10.16,8.26 v10.16,19.68
  Top 1.27: J4.TT J4.VV J4.UU J4.SS J4.TT | 121.28,57.78 120.65,57.78 C12.2 120.65,51.44 | 121.28,57.78 J4.TT | 137.16,57.78 C13.2 137.16,50.16 U8.7 | 137.16,57.78 121.28,57.78 | 153.03,57.78 C5.2 153.03,50.16 U7.7 | 153.03,57.78 137.16,57.78 | C4.2 170.81,57.78 167,57.78 | 167,57.78 153.03,57.78 | J4.A J4.B 167,60.96 | 167,60.96 167,57.78 | U9.7 120.65,50.16 120.65,51.44 | C1.2 191.77,69.85 191.13,69.22 187.32,69.22 186.06,67.94 U2.15 U2.16 U2.17 | U2.17 185.42,60.96 167,60.96 | U2.17 188.59,61.59 U2.10 196.85,59.69 196.85,67.31 198.75,69.22 213.36,69.22 C19.2 217.17,70.48 U11.4 U11.3 | J2.4 227.97,52.7 227.97,49.53 229.87,47.62 231.14,47.62 | 231.14,47.62 238.76,55.24 238.76,62.23 233.86,67.13 J5.5 233.86,66.85 231.14,64.14 U11.3 | U11.2 U11.1 217.17,53.98 | U11.2 U11.3 | C6.2 217.17,53.98 | 217.17,53.98 U3.7 214,45.72 v214,19.68 | 231.14,47.62 231.14,46.35 C17.1 C18.2 236.22,38.73 U10.15 238.12,35.56 234.95,35.56 233.04,33.66 233.04,27.3 226.69,20.95 226.69,8.89 226.38,8.57 J1.AN2 | v214,19.68 214,8.89 | C7.2 C9.2 120.65,51.44 | C2.2 60.33,54.61 U6.7 57.15,45.09 v57.15,19.68 | J3.6 76.2,69.85 85.09,69.85 | 85.09,69.85 C8.2 | C7.2 U1.8 81.28,51.44 U1.22 | C7.2 95.89,53.34 95.89,57.15 92.08,60.96 92.08,64.14 86.36,69.85 85.09,69.85 | J1.DC2 52.07,8.26 v52.07,19.68 | R20.1 105.41,26.04 99.06,19.68 v93.34,19.68 93.34,8.26 J1.CN2 | J1.CC2 121.28,8.26 v121.28,19.68 | J1.BC1 185.42,8.26 v185.42,19.68 | J1.AT2 214,8.26 v214,19.68 | J1.AC1 255.27,8.26 v255.27,19.68 | SW1.5 SW1.6 SW1.7 SW1.8 | R7.1 SW1.8 | SW1.8 36.2,62.23 27.3,62.23 19.68,55.24 C10.2 C3.2 | C3.2 13.34,49.53 U5.7 22.86,40.01 v22.86,19.68 | U11.7 U11.2
  Top 1.27: SW2.3 SW2.4 13.34,58.62 C3.2
  Bottom 1.27: J1.DT2 10.16,8.26 v10.16,19.68 v22.86,19.68 | v22.86,19.68 v52.07,19.68 | v52.07,19.68 v57.15,19.68 80.01,19.68 | 80.01,19.68 v93.34,19.68 | v93.34,19.68 v121.28,19.68 | v121.28,19.68 144.15,19.68 | 144.15,19.68 156.21,19.68 | 156.21,19.68 v185.42,19.68 | v185.42,19.68 v214,19.68 | v214,19.68 226.69,19.68 | 226.69,19.68 v255.27,19.68 255.27,8.26 J1.AC1 | J1.AN2 226.69,8.26 226.69,19.68 | J1.AT2 214,8.26 v214,19.68 | J1.BC1 185.42,8.26 v185.42,19.68 | J1.BT2 144.15,8.26 144.15,19.68 | J1.BN2 156.21,8.26 156.21,19.68 | J1.CC2 121.28,8.26 v121.28,19.68 | J1.CT2 80.01,8.26 80.01,19.68 | J1.CN2 93.34,8.26 v93.34,19.68 | J1.DC2 52.07,8.26 v52.07,19.68 | C4.2 170.81,50.16 U4.7 | J1.DN2 22.86,8.26 v22.86,19.68
  pour Bottom (isolate 0.813): 5.08,194.31 5.08,201.93 252.73,201.93 252.73,189.23 237.49,189.23 237.49,194.31
  pour Top: 0.64,80.01 265.43,80.01 265.43,18.41 0.64,18.41
INITIALIZE
  Top 0.508: Q1.1 73.03,21.59 77.47,17.14 84.45,17.14 86.36,15.24 | 86.36,15.24 86.36,8.89 86.68,8.57 J1.CR1 | U9.10 108.58,43.81 86.36,21.59 86.36,15.24
  Bottom 0.508: U9.9 U9.10
N$1
  Top 0.508: U1.10 C7.1
  Bottom 0.508: Y1.1 93.98,62.99 C7.1 90.81,59.69 R18.2
N$2
  Bottom 0.508: C9.1 99.06,62.87 98.93,62.99 Y1.2 | R18.1 102.23,59.69 C9.1 | U1.9 96.52,53.98 C9.1
N$4
  Bottom 0.508: Q1.3 66.67,34.92 R5.1
N$5
  Bottom 0.508: Q1.2 R10.2
N$6
  Bottom 0.508: R6.1 36.83,38.73 Q2.3
N$7
  Bottom 0.508: R11.2 40.01,36.83 Q2.2
N$8
  Top 0.508: U9.12 U9.3
N$9
  Top 0.508: U8.5 U8.4 U8.3
  Bottom 0.508: U8.12 U8.3
N$10  (via drill 0.81)
  Top 0.508: U8.8 v125.73,48.9 | v125.73,36.2 U9.2 U9.13
  Bottom 0.508: v125.73,36.2 v125.73,48.9
N$12  (via drill 0.81)
  Top 0.508: R17.1 v229.87,27.3 | U1.3 90.17,34.92 v90.17,27.3
  Bottom 0.508: v229.87,27.3 227.97,25.4 205.1,25.4 203.2,27.3 196.85,27.3 196.22,26.67 166.37,26.67 165.1,27.94 137.16,27.94 136.53,27.3 135.25,27.3 134.62,27.94 102.23,27.94 101.6,28.57 97.79,28.57 96.52,27.3 v90.17,27.3
N$13  (via drill 0.81)
  Top 0.508: R16.1 v225.43,24.13 | U1.2 88.27,34.29 v88.27,26.67
  Bottom 0.508: v225.43,24.13 224.79,24.77 204.47,24.77 202.56,26.67 197.49,26.67 196.85,26.04 165.74,26.04 165.1,26.67 102.23,26.67 100.97,27.94 98.42,27.94 96.52,26.04 88.9,26.04 v88.27,26.67
N$14
  Top 0.508: U9.6 128.27,46.35 U8.10
N$15
  Top 0.508: U8.11 127,45.09 120.65,45.09 116.84,48.9 U9.8
N$16
  Top 0.508: C17.2 236.22,47.62 245.11,47.62 U10.6
N$17
  Bottom 0.508: U10.1 C14.1
N$827
  Bottom 0.508: C14.2 U10.3
N$914
  Bottom 0.508: U10.5 248.92,43.81 250.19,45.09 C15.2
N$915
  Bottom 0.508: U10.4 249.56,41.27 C15.1
N$916
  Bottom 0.508: U10.2 252.73,36.2 C16.1
N$918  (via drill 0.81)
  Top 0.508: v20.95,59.05 v17.78,62.23
  Bottom 0.508: R12.2 20.32,46.99 20.32,58.42 v20.95,59.05 | SW2.1 12.7,70.28 12.7,64.34 SW2.2 12.42,63.78 12.7,63.5 16.51,63.5 v17.78,62.23
N$919
  Top 0.813: R3.2 48.26,60.96 45.72,63.5 SW1.1
N$920
  Top 0.813: SW1.2 47.62,66.67 R4.2
N$921
  Top 0.813: R8.2 SW1.3
N$922
  Top 0.813: SW1.4 47.62,71.75 R9.2
PROG  (via drill 0.81)
  Top 0.508: C11.2 v99.69,26.67 | J2.1 225.43,61.59 222.25,58.42 v222.25,44.45 v222.25,23.5 | U10.11 U10.12
  Bottom 0.508: R20.2 95.25,38.1 C11.2 | U10.12 238.12,44.45 v222.25,44.45 | v222.25,23.5 204.47,23.5 201.93,26.04 198.75,26.04 197.49,24.77 165.74,24.77 164.47,26.04 100.33,26.04 v99.69,26.67
PULSE_LA  (via drill 0.81)
  Top 0.813: Q2.1 41.91,31.75 26.67,17.14 v17.78,17.14
  Bottom 0.508: 16.51,8.26 17.14,8.89 17.14,15.88 17.78,16.51 v17.78,17.14
  Bottom 1.27: J1.DR2 16.51,8.26
R_RUN
  Bottom 0.508: U1.14 104.78,66.67 110.49,60.96 152.4,60.96 158.12,55.24 R2.1
R_SW
  Bottom 0.508: R12.1 R1.1 C10.1 23.5,62.87 35.56,74.93 70.48,74.93 U1.15
RXD
  Bottom 0.508: U10.9 236.22,51.44 233.04,48.26 227.33,48.26 R16.2 224.16,51.44 224.16,56.52 J2.2
RXD232  (via drill 0.81)
  Top 0.508: v177.8,69.22 v182.88,74.3
  Bottom 0.508: J4.J 160.66,64.77 160.66,67.94 161.93,69.22 v177.8,69.22 | v182.88,74.3 184.78,76.2 237.49,76.2 241.94,71.75 242.16,71.53 242.16,71.44 J5.2 242.16,63.91 246.38,59.69 U10.8
SCL  (via drill 0.81)
  Top 0.508: v199.39,24.77 R22.1 199.39,58.42 205.1,64.14 U11.6 | U1.28 v78.74,26.04
  Bottom 0.508: U2.12 198.12,61.59 199.39,60.33 R22.1 | v78.74,26.04 79.38,25.4 163.83,25.4 165.1,24.13 198.75,24.13 v199.39,24.77
SDA  (via drill 0.81)
  Top 0.508: v201.29,23.5 201.29,55.24 R21.1 | U1.27 76.83,34.29 v76.83,25.4
  Bottom 0.508: U2.13 203.2,64.14 | 203.2,64.14 R21.1 | U11.5 208.28,65.41 204.47,65.41 203.2,64.14 | v76.83,25.4 77.47,24.77 163.19,24.77 164.47,23.5 v201.29,23.5
SET_FF
  Bottom 0.508: U9.1 123.19,33.66 124.46,34.92 124.46,56.52 123.19,57.78 113.67,57.78 103.5,47.62 99.69,47.62 98.42,46.35 98.42,44.45 95.89,41.91 92.71,41.91 92.08,41.27 U1.4
SHOW_DATA
  Bottom 0.508: U1.5 88.27,43.81 92.71,48.26 102.87,48.26 113.67,59.05 138.43,59.05 140.97,56.52 140.97,34.92 139.7,33.66 U8.1
SW  (via drill 0.81)
  Top 0.508: R1.2 v31.75,25.4
  Bottom 0.508: J1.DV2 4.45,8.26 4.45,23.5 6.35,25.4 v31.75,25.4
TP4  (via drill 0.81)
  Top 0.508: v106.05,17.14 118.75,17.14 119.38,17.78 119.38,26.04 128.27,34.92 128.27,37.47 124.46,41.27 U9.4
  Bottom 0.508: J1.CJ2 106.05,8.26 v106.05,17.14 | U9.5 U9.4
TXD
  Bottom 0.508: U10.10 240.03,48.9 241.3,50.16 241.3,52.07 240.03,53.34 235.59,53.34 232.41,50.16 R17.2 229.87,55.24 228.6,56.52 J2.3
TXD232  (via drill 0.81)
  Top 0.508: v177.8,67.31 178.44,67.31 v184.15,73.03
  Bottom 0.508: J4.F 163.19,64.77 163.19,66.67 163.83,67.31 v177.8,67.31 | v184.15,73.03 186.69,75.56 236.85,75.56 239.4,73.03 J5.3 239.4,64.14 243.84,59.69 243.84,51.44 U10.7
VCC  (via drill 0.81)
  Top 0.813: J3.2 73.66,72.39 C8.1 | D1.C R19.2
  Top 1.27: U11.8 210.82,57.78 C6.1 | v187.96,31.11 187.96,57.15 U2.18
  Bottom 1.27: J1.AA2 261.62,8.26 261.62,27.94 258.44,31.11 255.27,31.11 | 255.27,31.11 238.76,31.11 | 238.76,31.11 209.55,31.11 | 209.55,31.11 v187.96,31.11 164.47,31.11 | 164.47,31.11 146.69,31.11 | 146.69,31.11 130.81,31.11 | 130.81,31.11 114.3,31.11 | 114.3,31.11 102.87,31.11 | 102.87,31.11 82.55,31.11 | 82.55,31.11 64.77,31.11 | 64.77,31.11 52.7,31.11 | 52.7,31.11 33.66,31.11 | 33.66,31.11 6.35,31.11 U5.14 8.26,33.66 8.89,34.29 8.89,52.07 8.26,52.7 C3.1 | 52.7,31.11 U6.14 50.16,35.56 50.16,50.16 54.61,54.61 C2.1 | R14.2 R6.2 33.66,53.34 33.66,31.11 | C16.2 255.27,31.11 | 238.76,31.11 U10.16 C18.1 | 209.55,31.11 U3.14 212.09,36.2 212.09,52.7 C6.1 | 146.69,31.11 U7.14 149.22,33.66 149.22,36.2 | 114.3,31.11 U9.14 116.2,35.56 116.2,54.61 C12.1 | U1.7 83.19,48.9 82.87,48.58 | 82.87,48.58 82.55,48.26 82.55,31.11 | U1.20 U1.21 81.28,51.44 | 81.28,51.44 82.87,49.21 82.87,48.58 | 81.28,51.44 81.28,71.12 C8.1 | 149.22,36.2 149.22,38.73 | 149.22,38.73 149.22,52.07 147.96,53.34 C5.1 | U7.12 149.22,38.73 | U7.13 149.22,36.2 | R19.2 102.87,40.01 102.87,31.11 | U2.9 192.41,53.98 187.32,59.05 U2.18 184.15,60.96 184.15,69.22 C1.1 188.59,73.66 198.12,73.66 R22.2 R21.2 | 64.77,31.11 64.77,40.64 66.67,42.55 R5.2 R13.2 | C13.1 132.08,52.7 127,47.62 127,37.47 U8.14 130.81,31.11 | 164.47,31.11 U4.14 166.37,33.66 167,34.29 167,53.98 C4.1 | C19.1 210.82,69.85 211.46,69.22 211.46,60.96 U11.8
  pour Top (isolate 0.813): 5.08,194.31 5.08,201.93 252.73,201.93 252.73,194.31
W_DATA_00
  Bottom 0.508: U3.1 220.34,33.66 220.98,34.29 220.98,53.98 218.44,56.52 207.01,56.52 199.39,48.9 U2.7
W_DATA_01
  Bottom 0.508: U2.6 198.75,46.35 207.65,55.24 217.81,55.24 219.71,53.34 219.71,41.91 219.07,41.27 U3.4
W_DATA_02
  Bottom 0.508: U2.5 201.93,43.81 204.47,46.35 U3.9
W_DATA_03
  Bottom 0.508: U2.3 U3.12
W_DATA_04
  Bottom 0.508: U4.1 173.35,33.66 174.62,34.92 189.23,34.92 190.5,36.2 U2.2
W_DATA_05
  Bottom 0.508: U2.1 192.41,32.38 170.18,32.38 169.54,33.02 169.54,40.01 170.81,41.27 U4.4
W_DATA_06
  Bottom 0.508: U2.27 180.97,36.2 175.26,41.91 175.26,54.61 172.09,57.78 164.47,57.78 162.56,55.88 162.56,48.26 U4.9
W_DATA_07
  Bottom 0.508: U4.12 161.29,41.91 161.29,56.52 163.83,59.05 172.72,59.05 176.53,55.24 176.53,48.26 U2.26
W_DATA_08
  Bottom 0.508: U2.25 180.97,46.35 180.97,69.85 175.26,75.56 34.92,75.56 16.51,57.15 16.51,34.29 15.88,33.66 U5.1
W_DATA_09
  Bottom 0.508: U5.4 15.24,42.55 15.24,57.15 34.29,76.2 175.9,76.2 181.61,70.48 181.61,50.8 U2.23
W_DATA_10
  Bottom 0.508: U2.22 184.78,48.9 182.25,51.44 182.25,71.12 176.53,76.83 7.62,76.83 4.45,73.66 4.45,48.26 U5.9
W_DATA_11
  Bottom 0.508: U5.12 3.81,41.27 3.81,74.3 6.99,77.47 177.16,77.47 182.88,71.75 182.88,54.61 U2.21
W_INITIALIZE
  Bottom 0.508: R10.1 74.3,43.81 | 74.3,43.81 R13.1 | U1.23 76.83,46.35 74.3,43.81
W_PULSE_LA  (via drill 0.81)
  Top 0.508: U1.24 65.41,43.81 63.5,45.72 v63.5,55.24
  Bottom 0.508: R14.1 43.18,43.81 R11.1 45.72,57.78 60.96,57.78 v63.5,55.24
W_STOP  (via drill 0.81)
  Top 0.508: v80.64,45.09 v84.45,45.09
  Bottom 0.508: U1.26 80.64,40.64 v80.64,45.09 | U7.10 U7.9 147.96,48.26 147.96,50.8 139.06,59.69 113.03,59.69 102.87,49.53 92.71,49.53 88.27,45.09 v84.45,45.09

### Text on the board
Top: 32K Omnibus Memory | VCC | M847 extended edition V1.1 | Roland Huisman | 30-10-2018 | Select | 10 | 4 | 2 | 1 | TTL DSR | TTL RXD | TTL TXD | GND
Bottom: GND
_tsilk: Lit.3V | B1 | CR2032H | 0.1uF | 0.1uF | 74LS74N | 74LS14N | 0.1uF | IC9 | IC8 | C1 | 74LS10N | 100K | 22uF | 0.1uF | 62256 | 62256 | 200pF | C2 | IC7 | 2N3904 | 100K | DIS | EN | 7 | IC3 | 6 | 10K | IC4 | 5 | 4 | 3 | 2 | R5 | 1 | 0.1uF | 0.1uF | 0 | S1 | ON | 0.1uF | 74ALS245AN | 74ALS245AN | 0.1uF | 74ACT138N | 74HCT30N | 10K | 10K | 10K | IC2 | IC1 | C10 | 100uF | 10K | IC6 | IC5 | DV1 | DU1 | DT1 | DS1 | DR1 | DP1 | DN1 | DM1 | DL1 | DK1 | DJ1 | DH1 | DF1 | DE1 | DD1 | DC1 | DB1 | DA1 | CV1 | CU1 | CT1 | CS1 | CR1 | CP1 | CN1 | CM1 | CL1 | CK1 | CJ1 | CH1 | CF1 | CE1 | CD1 | CC1 | CB1 | CA1 | BV1 | BU1 | BT1 | BS1 | BR1 | BP1 | BN1 | BM1 | BL1 | BK1 | BJ1 | BH1 | BF1 | BE1 | BD1 | BC1 | BB1 | BA1 | AV1 | AU1 | AT1 | AS1 | AR1 | AP1 | AN1 | AM1 | AL1 | AK1 | AJ1 | AH1 | AF1 | AE1 | AD1 | AC1 | AB1 | AA1
_bsilk: DV2 | DU2 | DT2 | DS2 | DR2 | DP2 | DN2 | DM2 | DL2 | DK2 | DJ2 | DH2 | DF2 | DE2 | DD2 | DC2 | DB2 | DA2 | CV2 | CU2 | CT2 | CS2 | CR2 | CP2 | CN2 | CM2 | CL2 | CK2 | CJ2 | CH2 | CF2 | CE2 | CD2 | CC2 | CB2 | CA2 | BV2 | BU2 | BT2 | BS2 | BR2 | BP2 | BN2 | BM2 | BL2 | BK2 | BJ2 | BH2 | BF2 | BE2 | BD2 | BC2 | BB2 | BA2 | AV2 | AU2 | AT2 | AS2 | AR2 | AP2 | AN2 | AM2 | AL2 | AK2 | AJ2 | AH2 | AF2 | AE2 | AD2 | AC2 | AB2 | AA2